# Altium schematic sheet microb.schdoc
size 54 x 45 mm
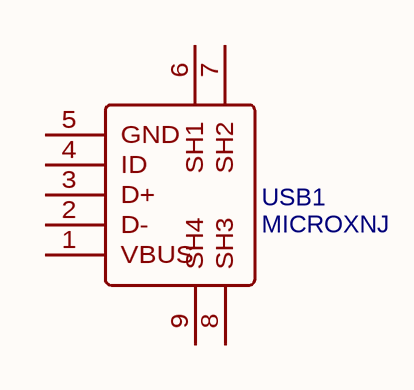
[diagram p0: microb.schdoc]

## Parts
USB1  MICROXNJ  [MICRO-USB-SMD_MICROXNJ]

## Nets

Not connected (* = marked no-connect by the designer): USB1 1(VBUS) 2(D-) 3(D+) 4(ID) 5(GND) 6(SH1) 7(SH2) 8(SH3) 9(SH4)

## Library data of the parts
USB1 = MICROXNJ: BOM_Manufacturer: SHOU HAN; Contributor: LCSC; BOM_Supplier: LCSC; BOM_Supplier Part: C404969; BOM_Manufacturer Part: MicroXNJ; BOM_JLCPCB Part Class: Extended Part; spicePre: U; spiceSymbolName: MICROXNJ